# EAGLE schematic amp-LO-QPA4463A (EAGLE 9.2.2)
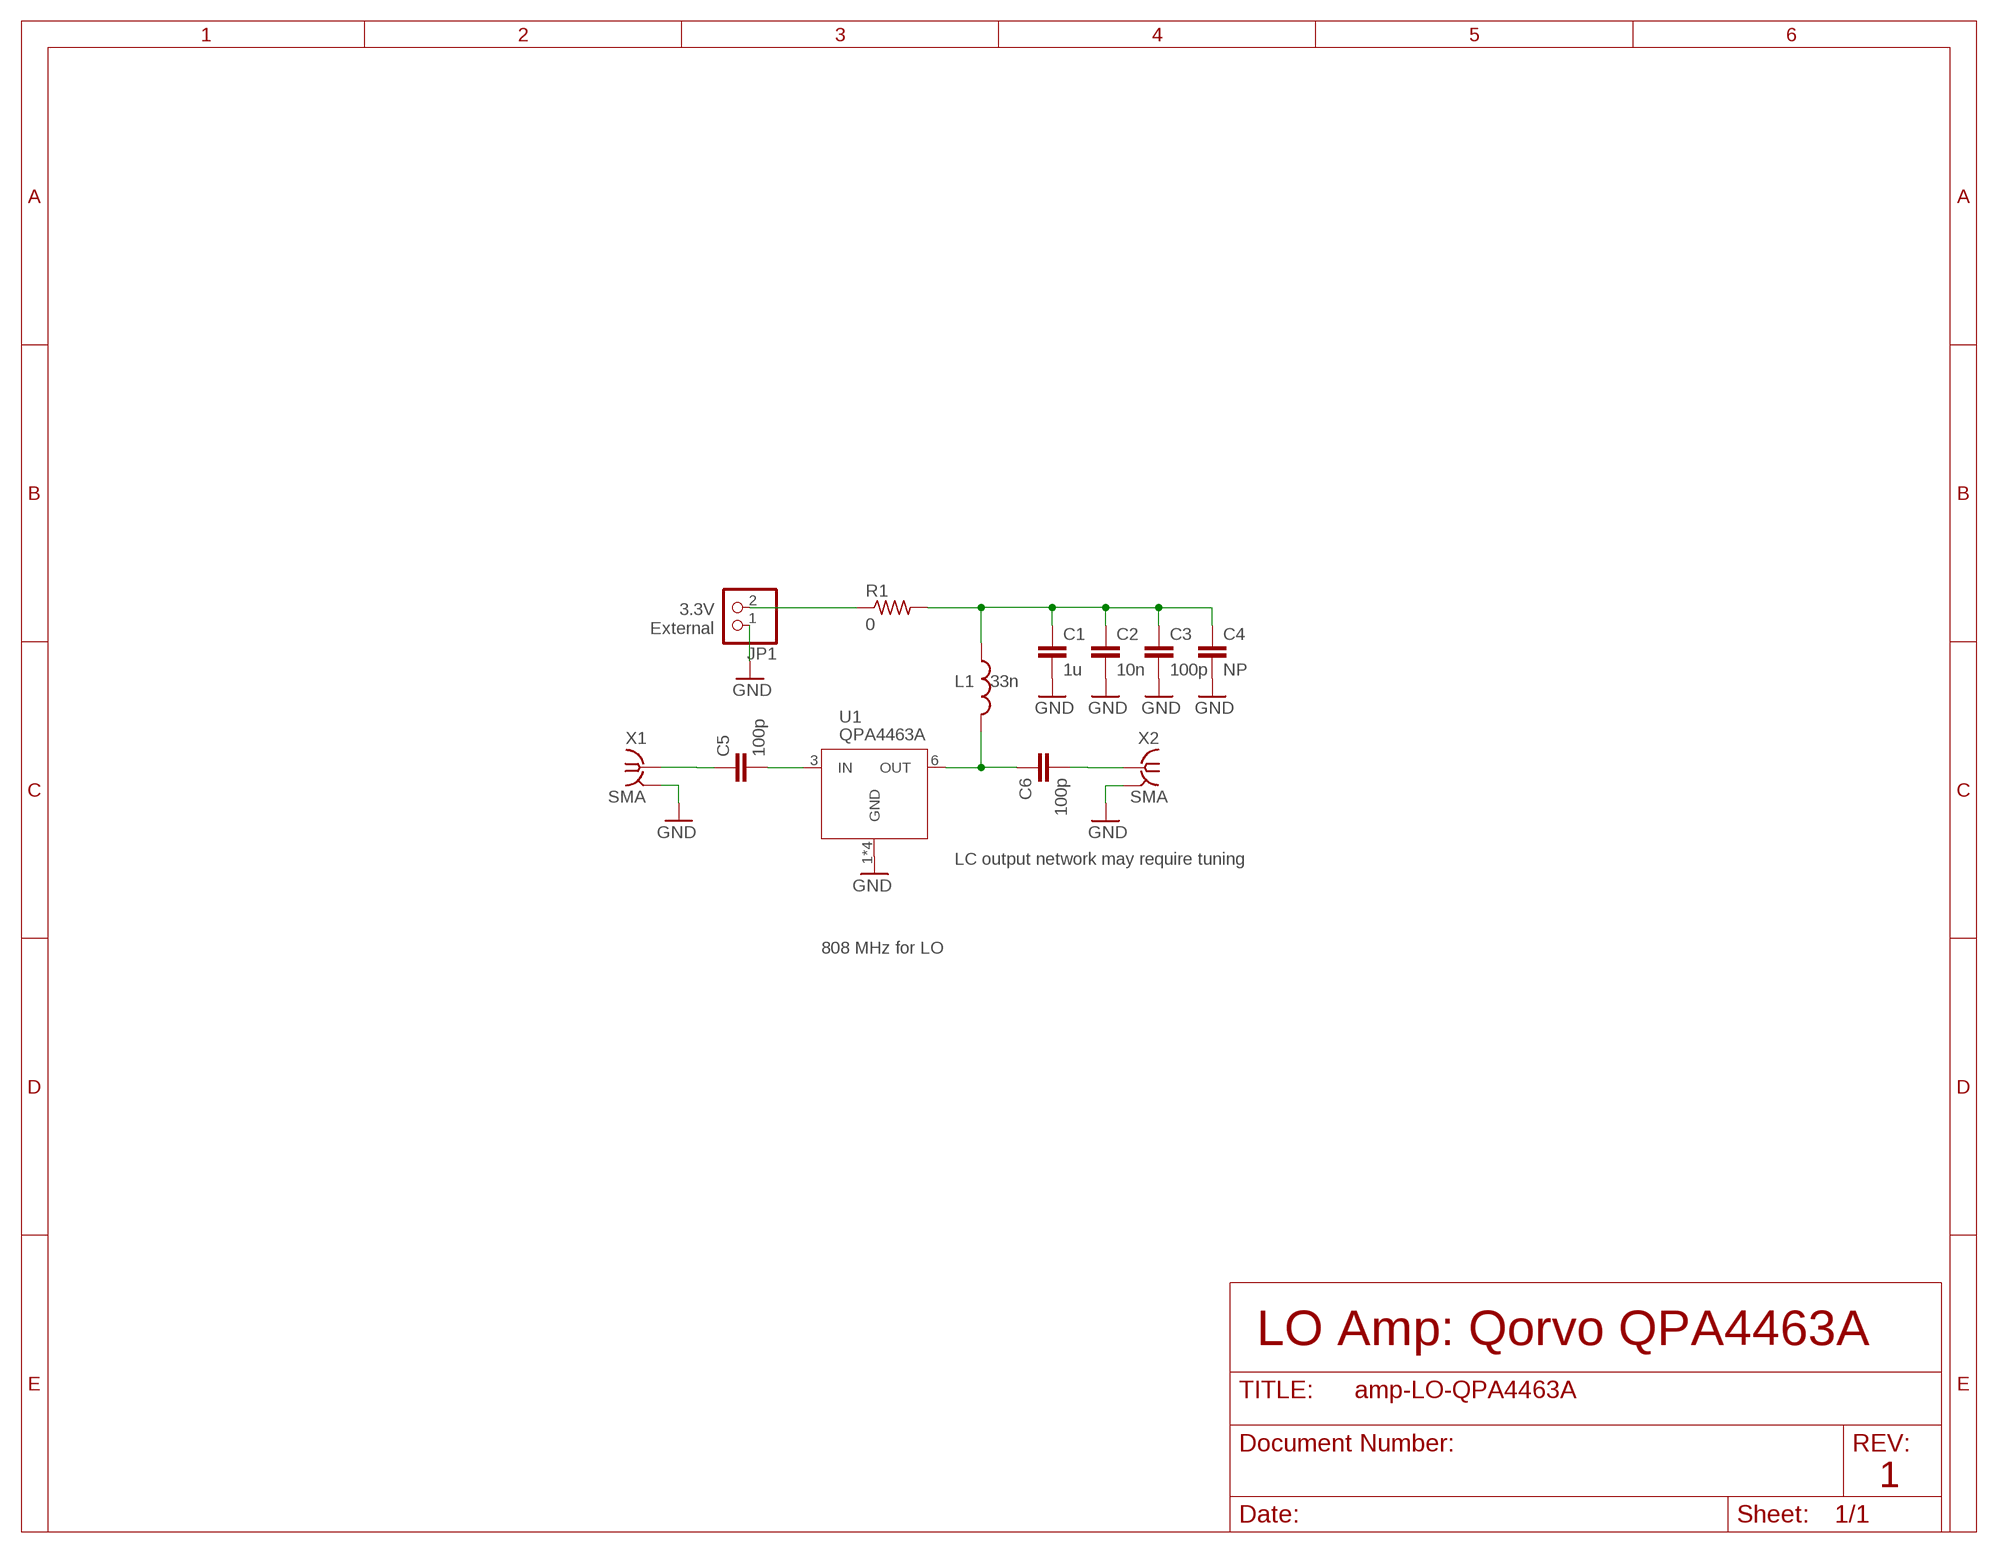
[diagram p0: schematic, sheet 1]

## Parts
C1  1u  C-EU0603-B-NOSILK  [.0603-B-NOSILK]
C2  10n  C-EU0603-B-NOSILK  [.0603-B-NOSILK]
C3  100p  C-EU0603-B-NOSILK  [.0603-B-NOSILK]
C4  NP  C-EU0603-B-NOSILK  [.0603-B-NOSILK]
C5  100p  C-EU0603-B-NOSILK  [.0603-B-NOSILK]
C6  100p  C-EU0603-B-NOSILK  [.0603-B-NOSILK]
JP1  PINHD-1X2  [1X02]
L1  33n  L-US0805-B-NOSILK  [.0805-B-NOSILK]
R1  0  R-US_0805-B-NOSILK  [.0805-B-NOSILK]
U1  QPA4463A  [SOT363]
X1  SMA  SMA-142-0701-801/806  [J502-ND-142-0701-801/806]
X2  SMA  SMA-142-0701-801/806  [J502-ND-142-0701-801/806]

## Nets
GND: C1.2 C2.2 C3.2 C4.2 JP1.1 U1.1(GND) U1.2(GND) U1.4(GND) U1.5(GND) X1.G@1 X1.G@2 X1.G@3 X1.G@4 X2.G@1 X2.G@2 X2.G@3 X2.G@4
N$1: JP1.2 R1.1
N$53: C6.1 L1.2 U1.6(OUT)
N$54: C5.2 U1.3(IN)
N$55: C6.2 X2.1
N$56: C5.1 X1.1
N$90: C1.1 C2.1 C3.1 C4.1 L1.1 R1.2

## Notes on the sheet
- 3.3V
  External
- LC output network may require tuning
- 808 MHz for LO
- LO Amp: Qorvo QPA4463A
- 1

## Library data of the parts
C1-C6 = oresat-rcl:C-EU: CAPACITOR, European symbol
JP1 = pinhead:PINHD-1X2: PIN HEADER
L1 = oresat-rcl:L-US: INDUCTOR, American symbol
R1 = oresat-rcl:R-US_: RESISTOR, American symbol
U1 = U-Qorvo-QPA4463A-amp:QPA4463A: DC - 3.5 GHz High Performance Amplifier
X1 X2 = con-coax:SMA-: SMA 50 Ohm End Launch Jack Receptacle - Round Contact Johnson Components Source: www.johnsoncomponents.com .. J502-ND.pdf; MF: JOHNSON COMPONENTS; MPN: 142-0701-801; OC_FARNELL: 1608592; OC_NEWARK: 90F2624